# Altium project Board1.PrjPcb
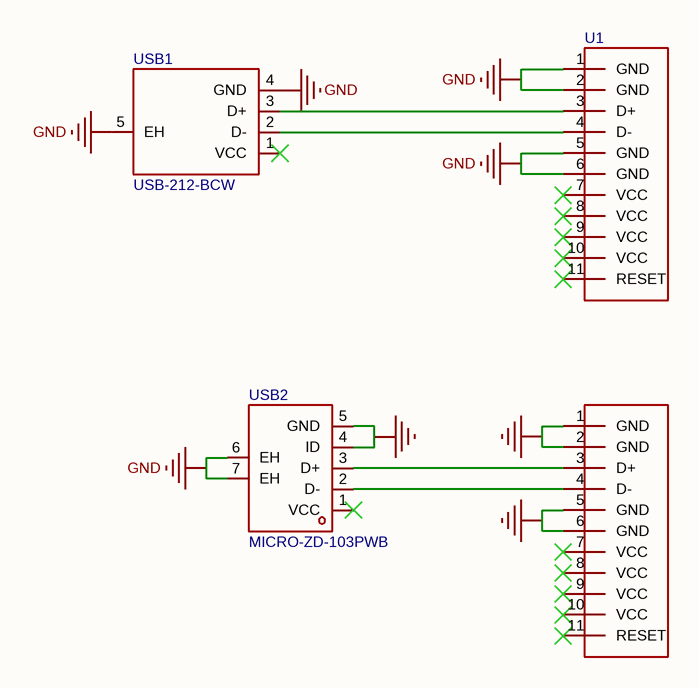
[diagram p0: P1.schdoc]
1 sheet, 4 parts. Net scope: global (net labels, ports and power ports of the same name join across sheets).
Board file: PCB1.pcbdoc

## Sheet P1.schdoc
size 297 x 209 mm; Symbol: Drawing-Symbol_A4; Company: 嘉立创EDA; Version: V1.0; Page Size: A4; @Project Name: USB-A-To-BLM8812EU2; @Update Date: 2026-06-13; @Create Date: 2026-06-13; Device: Drawing-Symbol_A4; @Board Name: Board1; @Page Name: P1; @Create Time: 07:38:37; @Page Count: 1; @Page No: 1; @Schematic Name: Schematic1; @Update Time: 07:38:37; @Assembly Variant: Basic; Border: 1; Title Block Position: 3; Size: A4; Width: 1170; Height: 825; Region Start: 1; X Region Count: 6; Y Region Count: 4; Blade Width: 10

### Parts
U1  (no value)  [BL-M8812EU2-FPC]
U2  (no value)  [BL-M8812EU2-FPC]
USB1  USB-212-BCW  [USB-A-SMD_USB-212-BCW]
USB2  MICRO-ZD-103PWB  [MICRO-USB-SMD_ZD-103PWB]

### Nets
GND: U1.1(GND) U1.2(GND) U1.5(GND) U1.6(GND) U2.1(GND) U2.2(GND) U2.5(GND) U2.6(GND) USB1.4(GND) USB1.5(EH) USB2.4(ID) USB2.5(GND) USB2.6(EH) USB2.7(EH)
NetU1_3: U1.3(D+) USB1.3(D+)
NetU1_4: U1.4(D-) USB1.2(D-)
NetU2_3: U2.3(D+) USB2.3(D+)
NetU2_4: U2.4(D-) USB2.2(D-)

Not connected (* = marked no-connect by the designer): U1 7(VCC)* 8(VCC)* 9(VCC)* 10(VCC)* 11(RESET)*; U2 7(VCC)* 8(VCC)* 9(VCC)* 10(VCC)* 11(RESET)*; USB1 1(VCC)*; USB2 1(VCC)*

### Notes on the sheet
- 创建日期
- 2026-06-13
- 原理图
- 板子
- Schematic1
- Board1
- 更新日期
- 图页
- P1
- 绘制
- 审阅
- USB-A-To-BLM8812EU2
- 版本
- V1.0
- 尺寸
- A4
- 页    1    共    1
- 嘉立创EDA

### Library data of the parts
U1 U2 = BL-M8812EU2-FPC: AddInBom: yes; Symbol: BL-M8812EU2-FPC; Device: BL-M8812EU2-FPC; ConvertToPcb: yes
USB1 = USB-212-BCW: 连接器类型:Type-A;协议标准:USB 2.0;公母:公;安装方式:卧贴;触点数量:4P;端口数量:1;额定电流 - 电源:1.5A;工作温度:-20℃~+70℃;; Manufacturer: XUNPU(讯普); AddInBom: yes; ModelId: 1b654133008c45b5bf0439418cddddbf0819f05c4eef4c71ace90d822a990e87; ModelTransform: 818.896,492.88146,0,90,0,0,-0.005,-340.448,-102.362; Connector Type: Type-A; Protocol Standard: USB 2.0; Gender: 公; Number of Contacts: 4P; Number of Ports: 1; Current Rating-Power: 1.5A; Voltage Rating: 30V; Connect-Disconnect Life: 5千次; Detection color: 黑色; Symbol: USB-212-BCW; Device: USB-212-BCW; LCSC Part Name: Type-A 公 卧贴; SupplierPart: C720521; ManufacturerPart: USB-212-BCW; Supplier Footprint: SMD; JLCPCB Part Class: Extended Part; Datasheet: https://item.szlcsc.com/datasheet/USB-212-BCW/763528.html; Supplier: LCSC; ConvertToPcb: yes; FootprintName: USB-A-SMD_USB-212-BCW; ModelName: USB-A-SMD_USB-212-BCW; Mounting Type: 卧贴; Length: 18.8mm; Operating Temperature: -20℃~+70℃
USB2 = MICRO-ZD-103PWB: 连接器类型:Micro-B;协议标准:USB 2.0;公母:公;安装方式:-;触点数量:5P;端口数量:1;额定电流 - 电源:2A；1A;工作温度:-20℃~+85℃;; Manufacturer: HDGC(华德共创); 3D Model: 5872660557914d9cae2d87772716cb090819f05c4eef4c71ace90d822a990e87; 3D Model Transform: 348.4245,456.69204,0,0,0,0,0,172.244,-43.307; Protocol Standard: USB 2.0; Gender: 公; Number of Contacts: 5P; Number of Ports: 1; Current Rating-Power: 2A；1A; Voltage Rating: 30V; Connect-Disconnect Life: 5千次; Detection color: 黑色; AddInBom: yes; Symbol: MICRO-ZD-103PWB; Device: MICRO-ZD-103PWB; LCSC Part Name: Micro-B 公; Supplier Part: C5295970; Manufacturer Part: MICRO-ZD-103PWB; Supplier Footprint: SMD; JLCPCB Part Class: Extended Part; Datasheet: https://item.szlcsc.com/datasheet/MICRO-ZD-103PWB/6040694.html; Supplier: LCSC; Connector Type: Micro-B; Mounting Type: -; Length: 9.7mm; Operating Temperature: -20℃~+85℃; ConvertToPcb: yes; FootprintName: MICRO-USB-SMD_ZD-103PWB; ModelName: MICRO-USB-SMD_ZD-103PWB